# Altium schematic sheet Mechanical_Holes.SchDoc: Title
size A4; Date: *******; ApprovedBy: *******; CheckedBy: None; Author: *******; CompanyName: *******; DrawnBy: Name; Engineer: *******; Organization: *******; Address1: *******; Address2: *******; Address3: *******; Address4: *******; DocumentNumber: 11; Revision: *******; SheetNumber: 11; SheetTotal: 11; CurrentTime: *******; CurrentDate: *******; Time: *******; DocumentFullPathAndName: *******; DocumentName: *******; ModifiedDate: *******; ImagePath: *******; ProjectName: *******; Application_BuildNumber: *******
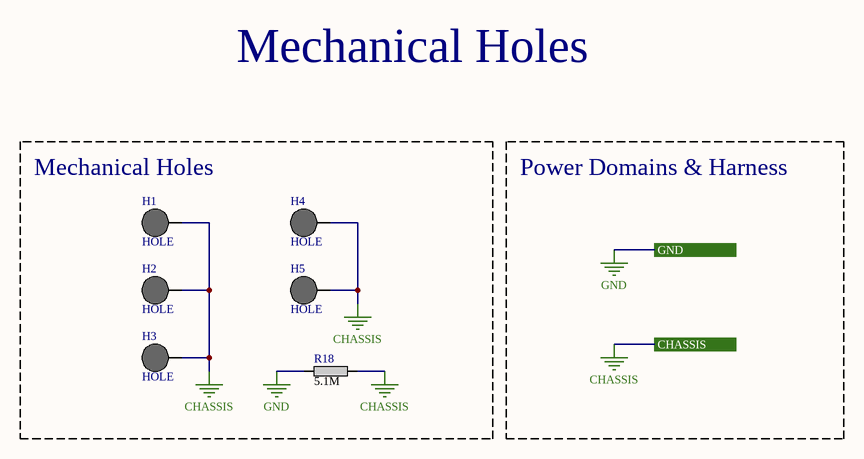
[diagram p0: Mechanical_Holes.SchDoc]

## Parts
H1  HOLE  [HOLE_M3]
H2  HOLE  [HOLE_M3]
H3  HOLE  [HOLE_M3]
H4  HOLE  [HOLE_M3]
H5  HOLE  [HOLE_M3]
R18  value 5.1M  [0805]  (hidden comment: RES)

## Blocks framed on the sheet
Mechanical Holes: H1-H5 R18

## Ports
CHASSIS (see Lens-Maker[3D], ESP32_Block[3D], USB_Connector[3C]), GND (see Lens-Maker[3D], A4988[3B], ESP32_Block[3D], ESP32_Module[3B], GPIO_Header[3B], I2C_Header[3B], Power[3C], SPI_Header[3B], Stepper_Driver[3B], USB_Connector[3B])

## Nets
CHASSIS: H1.1 H2.1 H3.1 H4.1 H5.1 R18.1 ; port CHASSIS
GND: R18.2 ; port GND

## Notes on the sheet
- Mechanical Holes
- Power Domains & Harness
- Title:
- Size:
- Date:
- Drawn By:
- Page Contents:
- A4
- Checked By:
- Revision:
- Sheet
- of

## Library data of the parts
H1-H5 = HOLE: Hole M3
R18 = RES: 125mW Thick Film Resistors ±1% 5.1MΩ 0805  Chip Resistor - Surface Mount ROHS; Manufacturer: TA-I Tech; Manufacturer Part Number: RM10FTN5104; Supplier: JLCPCB; Supplier Part Number: C156163